# EAGLE design RPi-Proto-HAT_v10 (EAGLE 6.6.0)
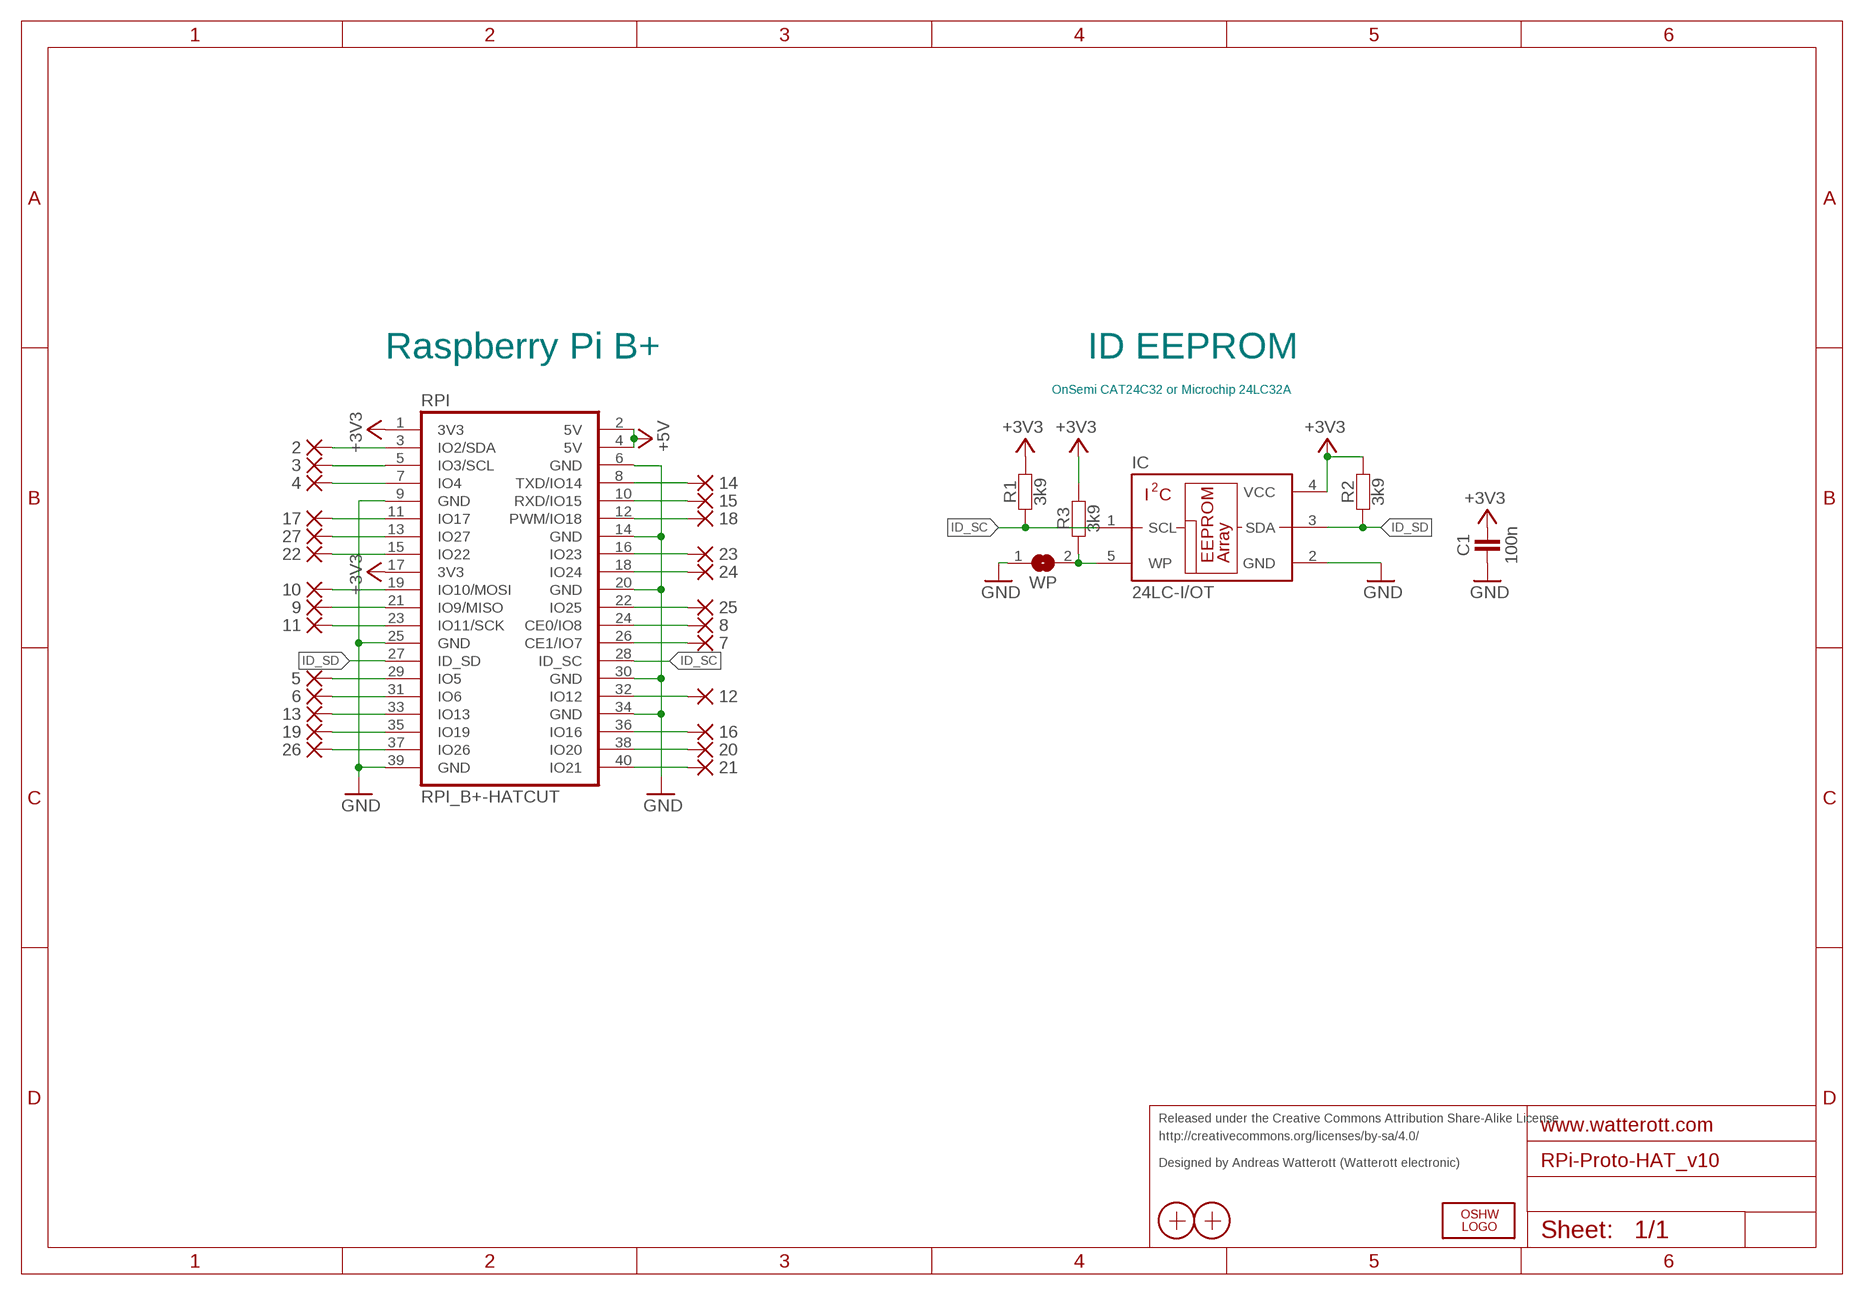
[diagram p0: schematic, sheet 1]

## Parts
2  PAD-1-1.6  [PAD-1-1.6]
3  PAD-1-1.6  [PAD-1-1.6]
4  PAD-1-1.6  [PAD-1-1.6]
5  PAD-1-1.6  [PAD-1-1.6]
6  PAD-1-1.6  [PAD-1-1.6]
7  PAD-1-1.6  [PAD-1-1.6]
8  PAD-1-1.6  [PAD-1-1.6]
9  PAD-1-1.6  [PAD-1-1.6]
10  PAD-1-1.6  [PAD-1-1.6]
11  PAD-1-1.6  [PAD-1-1.6]
12  PAD-1-1.6  [PAD-1-1.6]
13  PAD-1-1.6  [PAD-1-1.6]
14  PAD-1-1.6  [PAD-1-1.6]
15  PAD-1-1.6  [PAD-1-1.6]
16  PAD-1-1.6  [PAD-1-1.6]
17  PAD-1-1.6  [PAD-1-1.6]
18  PAD-1-1.6  [PAD-1-1.6]
19  PAD-1-1.6  [PAD-1-1.6]
20  PAD-1-1.6  [PAD-1-1.6]
21  PAD-1-1.6  [PAD-1-1.6]
22  PAD-1-1.6  [PAD-1-1.6]
23  PAD-1-1.6  [PAD-1-1.6]
24  PAD-1-1.6  [PAD-1-1.6]
25  PAD-1-1.6  [PAD-1-1.6]
26  PAD-1-1.6  [PAD-1-1.6]
27  PAD-1-1.6  [PAD-1-1.6]
C1  100n  CAPACITOR-C0603  [R0603]
IC  24LC-I/OT  [SOT23-5]
LOGO2  OSHW_LOGOX0070  [OSHW_6X70]
R1  3k9  RESISTOR-R0603  [R0603]
R2  3k9  RESISTOR-R0603  [R0603]
R3  3k9  RESISTOR-R0603  [R0603]
RPI  RPI_B+-HATCUT  [RPI-B+HAT_CUTOUT]
WP  JUMPER2-NOCREAM  [JUMPER2_NC]
X1  PASSER-07  [PASSER_07MM]
X2  PASSER-07  [PASSER_07MM]

## Nets
+3V3: C1.2 IC.4(VCC) R1.2 R2.2 R3.2 RPI.1(3V3) RPI.17(3V3)
+5V: RPI.2(5V) RPI.4(5V)
GND: C1.1 IC.2(GND) RPI.6(GND) RPI.9(GND) RPI.14(GND) RPI.20(GND) RPI.25(GND) RPI.30(GND) RPI.34(GND) RPI.39(GND) WP.1
ID_SC: IC.1(SCL) R1.1 RPI.28(ID_SC)
ID_SD: IC.3(SDA) R2.1 RPI.27(ID_SD)
IO2: 2.1(P) RPI.3(IO2/SDA)
IO3: 3.1(P) RPI.5(IO3/SCL)
IO4: 4.1(P) RPI.7(IO4)
IO5: 5.1(P) RPI.29(IO5)
IO6: 6.1(P) RPI.31(IO6)
IO7: 7.1(P) RPI.26(CE1/IO7)
IO8: 8.1(P) RPI.24(CE0/IO8)
IO9: 9.1(P) RPI.21(IO9/MISO)
IO10: 10.1(P) RPI.19(IO10/MOSI)
IO11: 11.1(P) RPI.23(IO11/SCK)
IO12: 12.1(P) RPI.32(IO12)
IO13: 13.1(P) RPI.33(IO13)
IO14: 14.1(P) RPI.8(TXD/IO14)
IO15: 15.1(P) RPI.10(RXD/IO15)
IO16: 16.1(P) RPI.36(IO16)
IO17: 17.1(P) RPI.11(IO17)
IO18: 18.1(P) RPI.12(PWM/IO18)
IO19: 19.1(P) RPI.35(IO19)
IO20: 20.1(P) RPI.38(IO20)
IO21: 21.1(P) RPI.40(IO21)
IO22: 22.1(P) RPI.15(IO22)
IO23: 23.1(P) RPI.16(IO23)
IO24: 24.1(P) RPI.18(IO24)
IO25: 25.1(P) RPI.22(IO25)
IO26: 26.1(P) RPI.37(IO26)
IO27: 27.1(P) RPI.13(IO27)
WP: IC.5(WP) R3.1 WP.2

## Notes on the sheet
- Raspberry Pi B+ | ID EEPROM
- OnSemi CAT24C32 or Microchip 24LC32A
- Released under the Creative Commons Attribution Share-Alike License
- http://creativecommons.org/licenses/by-sa/4.0/
- Designed by Andreas Watterott (Watterott electronic)

## Library data of the parts
2-27 = we-rcl:PAD
C1 = we-rcl:CAPACITOR: Capacitors ...2.2uF -> 0603 ...4.7uF -> 0805 ...10uF -> 1206
IC = we-chip:24LC*: Microchip I2C EEPROM 2 Kbit - 24LC02B - 24LC02BT-I/OTDKR-ND 32 Kbit- 24LC32A - 24LC32AT-I/OTDKR-ND; DIGIKEY: 24LC32AT-I/OTDKR-ND
LOGO2 = we-symbol:OSHW_LOGO
R1-R3 = we-rcl:RESISTOR
RPI = we-board:RPI_B+: Raspberry Pi Model B+
WP = we-rcl:JUMPER2
X1 X2 = we-symbol:PASSER

## Board
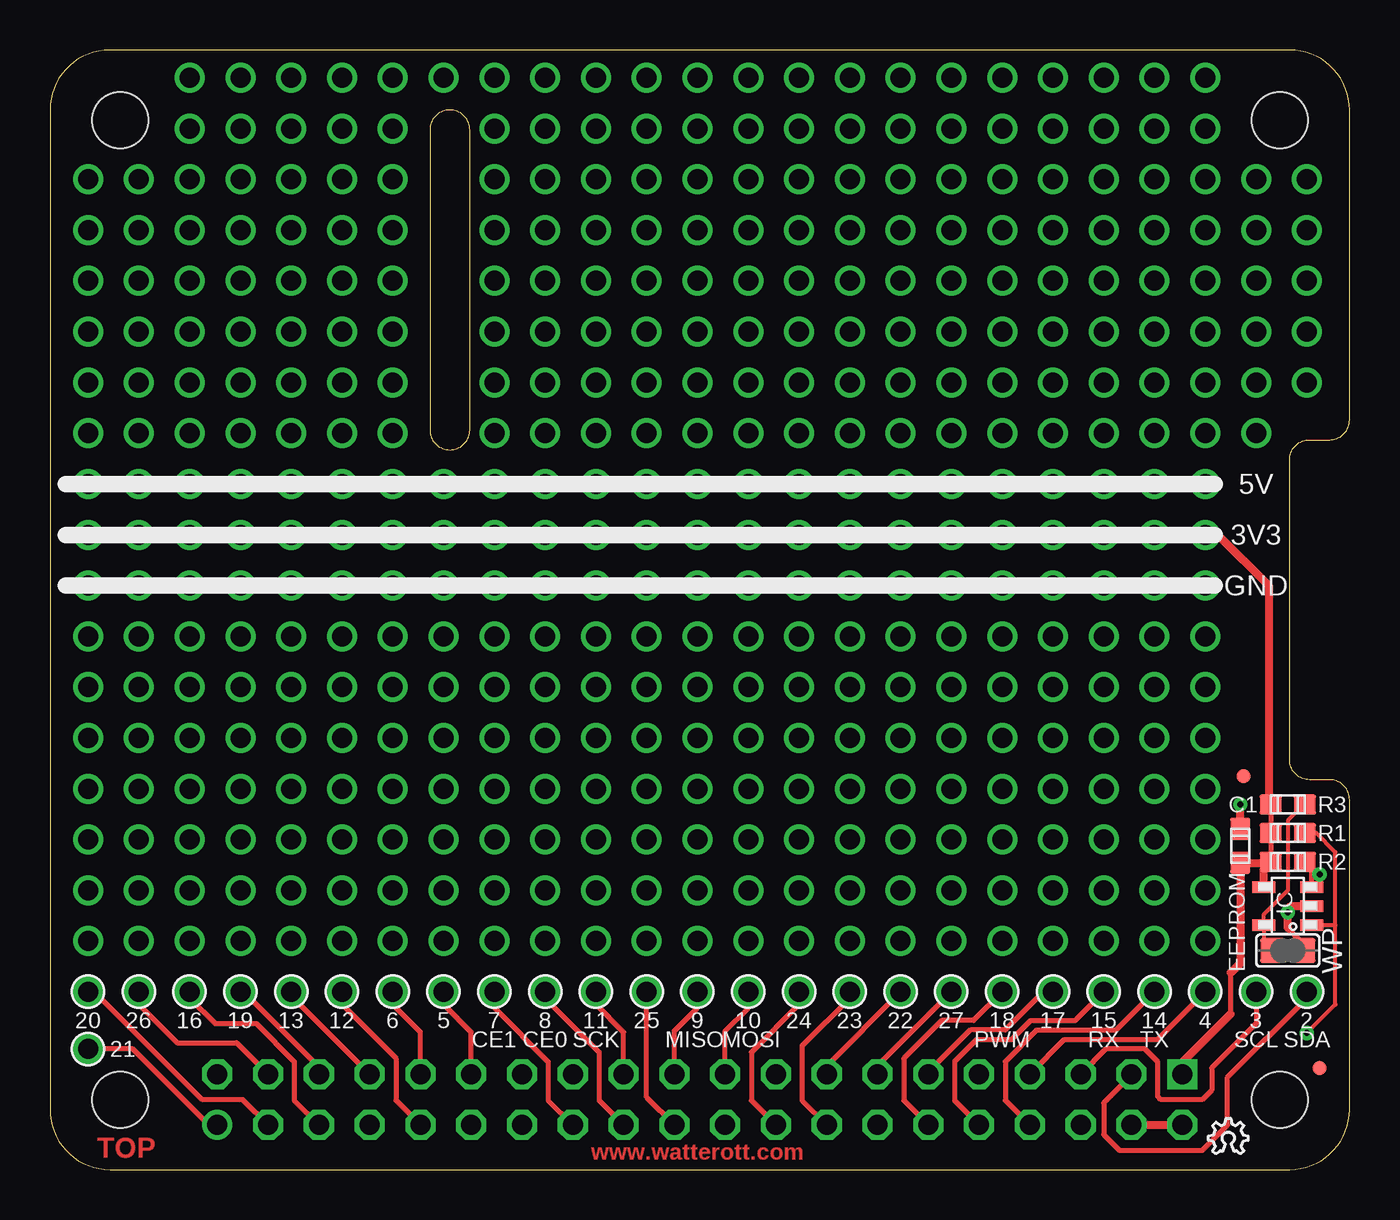
[diagram p1: board, top side]
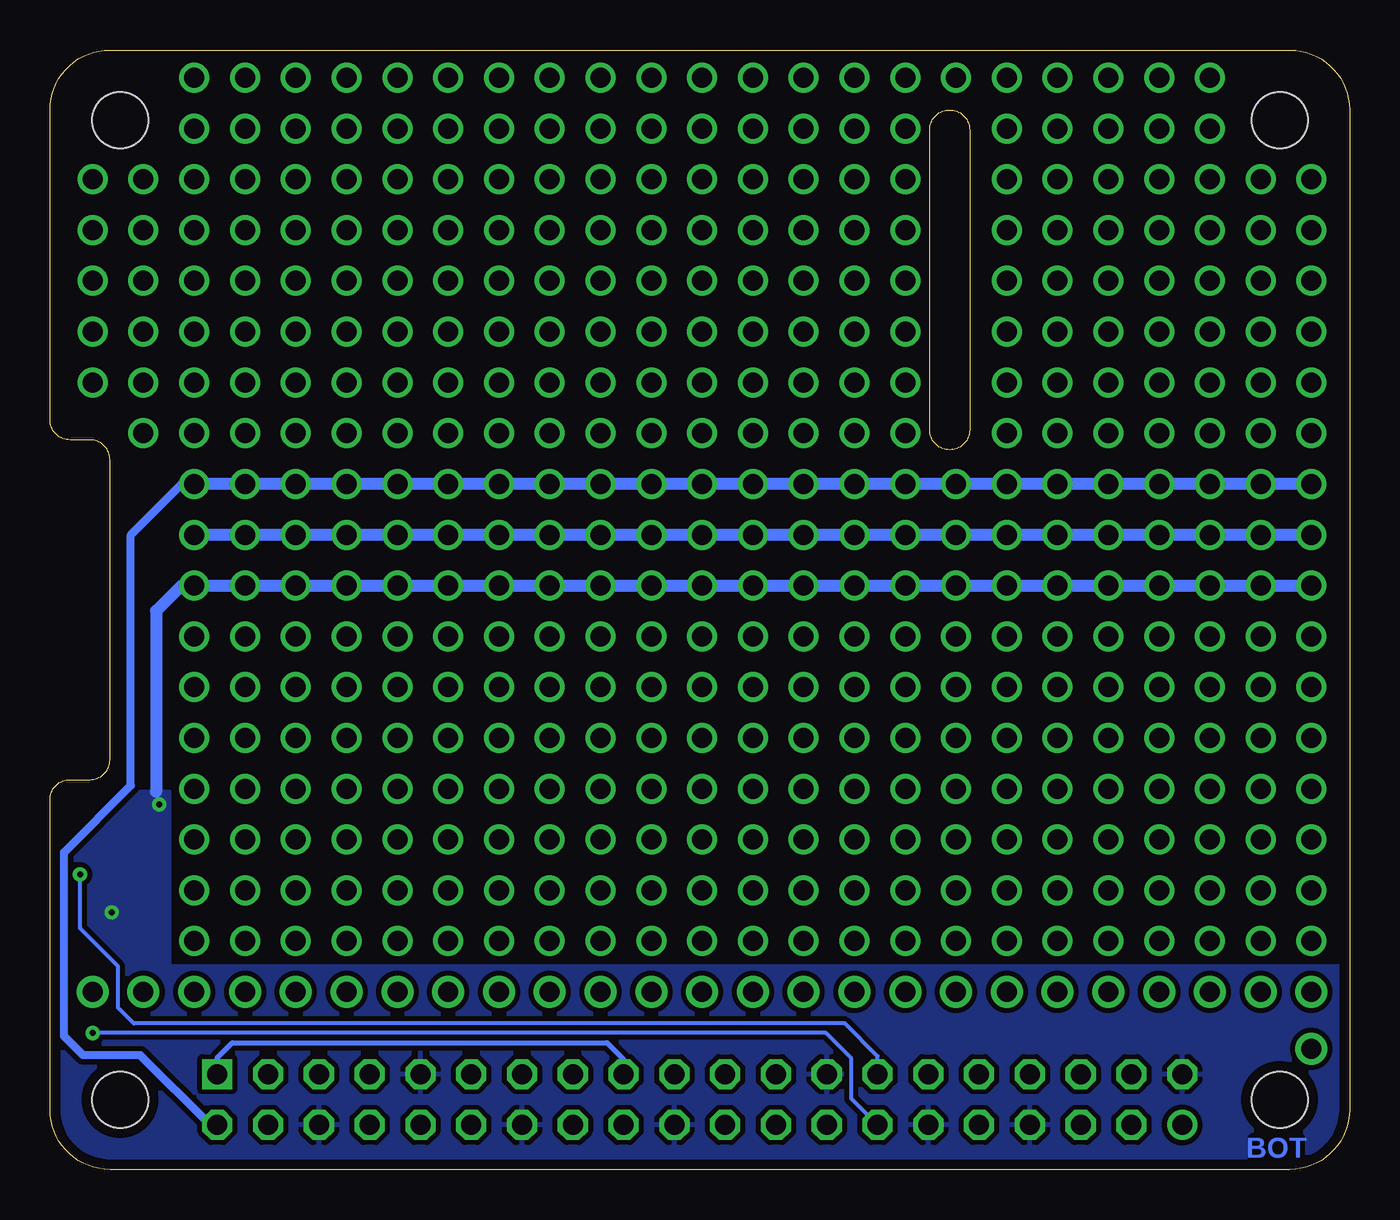
[diagram p2: board, bottom side, seen from below]

Size 65 x 56 mm. Coordinates in mm from the lower left corner, seen from the top.
Copper layers (1*16): Top 0.035mm / dielectric 1.5mm / Bottom 0.035mm
Design rules "default *": minimum track width 6mil, minimum drill 0.3mm, track to track 6mil, track to pad 6mil, pad to pad 6mil, via to via 6mil, smd to smd 6mil, copper to edge 20mil, drill to drill 8mil, minimum pad ring 10mil, minimum via ring 8mil, stop-mask expansion 0.3mm, vias tented up to drill 0.5mm, thermal gap 10mil

### Footprints (pad centres in the part's own frame; a part is rotated, then mirrored left to right if it is on the bottom)
PAD-1-1.6 = drill 1 pad 1.6: 1 0,0
R0603 = smd 1 x 1.1: 1 0,0.85; 2 0,-0.85
SOT23-5 = smd 1.2 x 0.6: 1 -1.2,0.95; 2 -1.2,0; 3 -1.2,-0.95; 4 1.2,-0.95; 5 1.2,0.95
RPI-B+HAT_CUTOUT = drill 1 square: 1 56.63,4.77 | drill 1 octagon: 2 56.63,2.23; 3 54.09,4.77; 4 54.09,2.23; 5 51.55,4.77; 6 51.55,2.23; 7 49.01,4.77; 8 49.01,2.23; 9 46.47,4.77; 10 46.47,2.23; 11 43.93,4.77; 12 43.93,2.23; 13 41.39,4.77; 14 41.39,2.23; 15 38.85,4.77; 16 38.85,2.23; 17 36.31,4.77; 18 36.31,2.23; 19 33.77,4.77; 20 33.77,2.23; 21 31.23,4.77; 22 31.23,2.23; 23 28.69,4.77; 24 28.69,2.23; 25 26.15,4.77; 26 26.15,2.23; 27 23.61,4.77; 28 23.61,2.23; 29 21.07,4.77; 30 21.07,2.23; 31 18.53,4.77; 32 18.53,2.23; 33 15.99,4.77; 34 15.99,2.23; 35 13.45,4.77; 36 13.45,2.23; 37 10.91,4.77; 38 10.91,2.23; 39 8.37,4.77 | drill 1: 40 8.37,2.23 | hole 2.8: 3.5,3.5; 3.5,52.5; 61.5,52.5; 61.5,3.5
JUMPER2_NC = smd 1.25 x 1.25: 1 0,0.76; 2 0,-0.76
PASSER_07MM = smd 0.7 x 0.7: X 0,0

### Placement (x,y rotation side)
2  62.87,8.89 0 top
3  60.33,8.89 0 top
4  57.78,8.89 0 top
5  19.68,8.89 0 top
6  17.14,8.89 0 top
7  22.23,8.89 0 top
8  24.77,8.89 0 top
9  32.38,8.89 0 top
10  34.92,8.89 0 top
11  27.3,8.89 0 top
12  14.61,8.89 0 top
13  12.06,8.89 0 top
14  55.24,8.89 0 top
15  52.7,8.89 0 top
16  6.99,8.89 0 top
17  50.16,8.89 0 top
18  47.62,8.89 0 top
19  9.53,8.89 0 top
20  1.91,8.89 0 top
21  1.91,6.03 0 top
22  42.55,8.89 0 top
23  40.01,8.89 0 top
24  37.47,8.89 0 top
25  29.84,8.89 0 top
26  4.45,8.89 0 top
27  45.09,8.89 0 top
C1  59.53,16.19 0 top
IC  61.91,13.18 180 top
LOGO2  57.94,0.79 0 top
R1  61.91,16.83 270 top
R2  61.91,15.4 270 top
R3  61.91,18.26 270 top
RPI  0,0 0 top
WP  61.91,10.95 270 top
X1  59.69,19.68 0 top
X2  63.5,5.08 0 top

### Tracks (layer width: path | path; a pad name or v marks a point on that pad's centre or on a via)
+3V3  (via drill 1)
  Top 0.254: R1.2 R3.2 60.96,18.36 | R1.2 61.06,16.73 61.12,16.67 61.12,16.77 R1.2 | R1.2 R2.2 60.93,15.27 60.71,15.05 | 59.53,15.4 C1.2 | 59.05,7.78 59.05,9.84
  Top 0.406: IC.4 60.71,15.05 | 60.93,15.27 60.86,15.34 C1.2 59.53,10.32 59.05,9.84 | v57.78,31.75 58.42,31.75 60.96,29.21 60.96,18.36 | RPI.1 56.63,5.35 59.05,7.78
  Top 0.61: v1.91,31.75 v57.78,31.75
  Bottom 0.254: RPI.1 56.63,5.6 55.88,6.35 37.15,6.35 36.31,5.51 RPI.17
  Bottom 0.61: v1.91,31.75 v57.78,31.75
+5V  (via drill 1)
  Top 0.406: RPI.4 RPI.2
  Top 0.61: v1.91,34.29 v57.78,34.29
  Bottom 0.406: RPI.2 57,2.23 60.48,5.71 63.34,5.71 64.29,6.67 64.29,15.88 60.96,19.21 60.96,31.75 58.42,34.29 v57.78,34.29
  Bottom 0.61: v1.91,34.29 v57.78,34.29
GND  (via drill 0.3, 1)
  Top 0.254: WP.1 62.67,11.3 61.91,12.06 | v61.91,12.86 61.91,13.02
  Top 0.406: 61.91,12.06 v61.91,12.86 | 61.91,13.02 62.07,13.18 IC.2 | C1.1 v59.53,18.26
  Top 0.61: v1.91,29.21 v57.78,29.21
  Bottom 0.406: v57.78,29.21 58.42,29.21
  Bottom 0.61: v57.78,29.21 v1.91,29.21 | 58.42,29.21 59.69,27.94 59.69,18.89
  pour Bottom (isolate 0.254): 0.32,0 64.77,0 64.77,10.16 0.32,10.16
  pour Bottom (isolate 0.254): 59.05,10.16 64.77,10.16 64.77,18.89 59.05,18.89
ID_SC  (via drill 0.3)
  Top 0.203: 64.29,12.22 64.29,15.88 63.34,16.83 R1.1 | 64.29,12.22 IC.1 | v62.87,6.83 64.29,8.26 64.29,12.22
  Bottom 0.203: RPI.28 24.92,3.54 24.92,5.56 26.19,6.83 v62.87,6.83
ID_SD  (via drill 0.3)
  Top 0.254: IC.3 63.11,14.76 | 63.11,14.76 63.11,15.05 R2.1 | v63.5,14.76 63.11,14.76
  Bottom 0.203: RPI.27 23.61,5.67 25.24,7.3 60.8,7.3 61.59,8.1 61.59,10.16 63.5,12.06 v63.5,14.76
IO2
  Top 0.254: 2.1 62.87,8.57 58.9,4.6 58.9,2.22 57.63,0.95 53.5,0.95 52.7,1.75 52.7,3.33 54.09,4.72 RPI.3
IO3
  Top 0.254: 3.1 60.33,7.3 58.1,5.08 58.1,3.97 57.63,3.49 55.56,3.49 55.4,3.65 55.4,5.4 54.77,6.03 52.81,6.03 RPI.5
IO4
  Top 0.254: RPI.7 50.75,6.51 55.4,6.51 4.1
IO5
  Top 0.254: 5.1 19.68,8.26 21.07,6.87 RPI.29
IO6
  Top 0.254: 6.1 17.14,8.26 18.53,6.87 RPI.31
IO7
  Top 0.254: 7.1 22.23,8.1 24.92,5.4 24.92,3.46 RPI.26
IO8
  Top 0.254: 8.1 24.77,8.57 27.46,5.87 27.46,3.46 RPI.24
IO9
  Top 0.254: 9.1 32.38,8.1 31.23,6.94 RPI.21
IO10
  Top 0.254: RPI.19 33.77,6.94 34.92,8.1 10.1
IO11
  Top 0.254: RPI.23 28.69,6.87 27.3,8.26 11.1
IO12
  Top 0.254: 12.1 14.61,8.26 17.3,5.56 17.3,3.46 RPI.32
IO13
  Top 0.254: 13.1 12.06,8.7 RPI.33
IO14
  Top 0.254: RPI.8 47.78,3.46 47.78,5.4 49.37,6.99 53.34,6.99 14.1
IO15
  Top 0.254: 15.1 51.28,7.46 49.05,7.46 48.1,6.51 46.35,6.51 45.24,5.4 45.24,3.46 RPI.10
IO16
  Top 0.254: 16.1 6.99,8.57 8.26,7.3 10.32,7.3 12.22,5.4 12.22,3.46 RPI.36
IO17
  Top 0.254: RPI.11 43.93,4.88 46.04,6.99 47.78,6.99 49.69,8.89 17.1
IO18
  Top 0.254: 18.1 46.2,7.46 44.61,7.46 42.7,5.56 42.7,3.46 RPI.12
IO19
  Top 0.254: RPI.35 13.45,5.12 9.68,8.89 19.1
IO20
  Top 0.254: 20.1 2.22,8.89 7.62,3.49 9.65,3.49 RPI.38
IO21
  Top 0.254: RPI.40 7.93,2.23 4.13,6.03 21.1
IO22
  Top 0.254: RPI.15 38.85,5.2 22.1
IO23
  Top 0.254: 23.1 40.01,8.57 37.62,6.19 37.62,3.46 RPI.16
IO24
  Top 0.254: 24.1 37.47,8.26 35.08,5.87 35.08,3.46 RPI.18
IO25
  Top 0.254: 25.1 29.84,3.62 RPI.22
IO26
  Top 0.254: 26.1 4.45,8.26 6.35,6.35 9.33,6.35 RPI.37
IO27
  Top 0.254: RPI.13 41.39,5.2 27.1
N$1  (via drill 1)
  other vias: 17.14,49.53
N$2  (via drill 1)
  other vias: 22.23,49.53
N$3  (via drill 1)
  other vias: 24.77,49.53
N$4  (via drill 1)
  other vias: 27.3,49.53
N$5  (via drill 1)
  other vias: 29.84,49.53
N$6  (via drill 1)
  other vias: 32.38,49.53
N$7  (via drill 1)
  other vias: 34.92,49.53
N$8  (via drill 1)
  other vias: 37.47,49.53
N$9  (via drill 1)
  other vias: 40.01,49.53
N$10  (via drill 1)
  other vias: 42.55,49.53
N$11  (via drill 1)
  other vias: 45.09,49.53
N$12  (via drill 1)
  other vias: 47.62,49.53
N$13  (via drill 1)
  other vias: 50.16,49.53
N$14  (via drill 1)
  other vias: 52.7,49.53
N$15  (via drill 1)
  other vias: 55.24,49.53
N$16  (via drill 1)
  other vias: 57.78,49.53
N$17  (via drill 1)
  other vias: 60.33,49.53
N$18  (via drill 1)
  other vias: 1.91,46.99
N$19  (via drill 1)
  other vias: 4.45,46.99
N$20  (via drill 1)
  other vias: 6.99,46.99
N$21  (via drill 1)
  other vias: 9.53,46.99
N$22  (via drill 1)
  other vias: 12.06,46.99
N$23  (via drill 1)
  other vias: 14.61,46.99
N$24  (via drill 1)
  other vias: 17.14,46.99
N$25  (via drill 1)
  other vias: 1.91,49.53
N$26  (via drill 1)
  other vias: 22.23,46.99
N$27  (via drill 1)
  other vias: 24.77,46.99
N$28  (via drill 1)
  other vias: 27.3,46.99
N$29  (via drill 1)
  other vias: 29.84,46.99
N$30  (via drill 1)
  other vias: 32.38,46.99
N$31  (via drill 1)
  other vias: 34.92,46.99
N$32  (via drill 1)
  other vias: 37.47,46.99
N$33  (via drill 1)
  other vias: 40.01,46.99
N$34  (via drill 1)
  other vias: 42.55,46.99
N$35  (via drill 1)
  other vias: 45.09,46.99
N$36  (via drill 1)
  other vias: 47.62,46.99
N$37  (via drill 1)
  other vias: 50.16,46.99
N$38  (via drill 1)
  other vias: 52.7,46.99
N$39  (via drill 1)
  other vias: 55.24,46.99
N$40  (via drill 1)
  other vias: 57.78,46.99
N$41  (via drill 1)
  other vias: 60.33,46.99
N$42  (via drill 1)
  other vias: 62.87,49.53
N$43  (via drill 1)
  other vias: 62.87,46.99
N$44  (via drill 1)
  other vias: 1.91,44.45
N$45  (via drill 1)
  other vias: 4.45,44.45
N$46  (via drill 1)
  other vias: 6.99,44.45
N$47  (via drill 1)
  other vias: 9.53,44.45
N$48  (via drill 1)
  other vias: 1.91,41.91
N$49  (via drill 1)
  other vias: 4.45,41.91
N$50  (via drill 1)
  other vias: 6.99,41.91
N$51  (via drill 1)
  other vias: 12.06,44.45
N$52  (via drill 1)
  other vias: 1.91,39.37
N$53  (via drill 1)
  other vias: 1.91,36.83
N$57  (via drill 1)
  other vias: 1.91,26.67
N$58  (via drill 1)
  other vias: 1.91,24.13
N$59  (via drill 1)
  other vias: 1.91,21.59
N$60  (via drill 1)
  other vias: 1.91,19.05
N$61  (via drill 1)
  other vias: 1.91,16.51
N$62  (via drill 1)
  other vias: 1.91,13.97
N$63  (via drill 1)
  other vias: 1.91,11.43
N$65  (via drill 1)
  other vias: 4.45,39.37
N$66  (via drill 1)
  other vias: 6.99,39.37
N$67  (via drill 1)
  other vias: 6.99,52.07
N$68  (via drill 1)
  other vias: 6.99,54.61
N$69  (via drill 1)
  other vias: 9.53,52.07
N$70  (via drill 1)
  other vias: 9.53,54.61
N$71  (via drill 1)
  other vias: 12.06,54.61
N$72  (via drill 1)
  other vias: 12.06,52.07
N$73  (via drill 1)
  other vias: 14.61,52.07
N$74  (via drill 1)
  other vias: 14.61,54.61
N$75  (via drill 1)
  other vias: 17.14,54.61
N$76  (via drill 1)
  other vias: 17.14,52.07
N$77  (via drill 1)
  other vias: 19.68,54.61
N$78  (via drill 1)
  other vias: 4.45,49.53
N$79  (via drill 1)
  other vias: 22.23,52.07
N$80  (via drill 1)
  other vias: 22.23,54.61
N$81  (via drill 1)
  other vias: 24.77,54.61
N$82  (via drill 1)
  other vias: 24.77,52.07
N$83  (via drill 1)
  other vias: 27.3,52.07
N$84  (via drill 1)
  other vias: 27.3,54.61
N$85  (via drill 1)
  other vias: 29.84,52.07
N$86  (via drill 1)
  other vias: 29.84,54.61
N$87  (via drill 1)
  other vias: 32.38,54.61
N$88  (via drill 1)
  other vias: 32.38,52.07
N$89  (via drill 1)
  other vias: 34.92,52.07
N$90  (via drill 1)
  other vias: 34.92,54.61
N$91  (via drill 1)
  other vias: 37.47,54.61
N$92  (via drill 1)
  other vias: 37.47,52.07
N$93  (via drill 1)
  other vias: 40.01,52.07
N$94  (via drill 1)
  other vias: 40.01,54.61
N$95  (via drill 1)
  other vias: 42.55,54.61
N$96  (via drill 1)
  other vias: 42.55,52.07
N$97  (via drill 1)
  other vias: 45.09,52.07
N$98  (via drill 1)
  other vias: 45.09,54.61
N$99  (via drill 1)
  other vias: 47.62,54.61
N$100  (via drill 1)
  other vias: 47.62,52.07
N$101  (via drill 1)
  other vias: 50.16,52.07
N$102  (via drill 1)
  other vias: 50.16,54.61
N$103  (via drill 1)
  other vias: 52.7,54.61
N$104  (via drill 1)
  other vias: 52.7,52.07
N$105  (via drill 1)
  other vias: 55.24,52.07
N$106  (via drill 1)
  other vias: 55.24,54.61
N$107  (via drill 1)
  other vias: 57.78,54.61
N$108  (via drill 1)
  other vias: 57.78,52.07
N$109  (via drill 1)
  other vias: 14.61,44.45
N$111  (via drill 1)
  other vias: 4.45,11.43
N$112  (via drill 1)
  other vias: 4.45,13.97
N$113  (via drill 1)
  other vias: 4.45,16.51
N$114  (via drill 1)
  other vias: 4.45,19.05
N$115  (via drill 1)
  other vias: 4.45,21.59
N$116  (via drill 1)
  other vias: 4.45,24.13
N$117  (via drill 1)
  other vias: 4.45,26.67
N$118  (via drill 1)
  other vias: 4.45,29.21
N$119  (via drill 1)
  other vias: 4.45,31.75
N$120  (via drill 1)
  other vias: 4.45,34.29
N$121  (via drill 1)
  other vias: 4.45,36.83
N$122  (via drill 1)
  other vias: 6.99,36.83
N$123  (via drill 1)
  other vias: 6.99,34.29
N$124  (via drill 1)
  other vias: 6.99,31.75
N$125  (via drill 1)
  other vias: 6.99,29.21
N$126  (via drill 1)
  other vias: 6.99,26.67
N$127  (via drill 1)
  other vias: 6.99,24.13
N$128  (via drill 1)
  other vias: 6.99,21.59
N$129  (via drill 1)
  other vias: 6.99,19.05
N$130  (via drill 1)
  other vias: 6.99,16.51
N$131  (via drill 1)
  other vias: 6.99,13.97
N$132  (via drill 1)
  other vias: 6.99,11.43
N$135  (via drill 1)
  other vias: 9.53,11.43
N$136  (via drill 1)
  other vias: 9.53,13.97
N$137  (via drill 1)
  other vias: 9.53,16.51
N$138  (via drill 1)
  other vias: 9.53,19.05
N$139  (via drill 1)
  other vias: 9.53,21.59
N$140  (via drill 1)
  other vias: 9.53,24.13
N$141  (via drill 1)
  other vias: 9.53,26.67
N$142  (via drill 1)
  other vias: 9.53,29.21
N$143  (via drill 1)
  other vias: 9.53,31.75
N$144  (via drill 1)
  other vias: 9.53,34.29
N$145  (via drill 1)
  other vias: 9.53,36.83
N$146  (via drill 1)
  other vias: 9.53,39.37
N$147  (via drill 1)
  other vias: 9.53,41.91
N$148  (via drill 1)
  other vias: 12.06,41.91
N$149  (via drill 1)
  other vias: 14.61,41.91
N$150  (via drill 1)
  other vias: 17.14,41.91
N$151  (via drill 1)
  other vias: 17.14,44.45
N$152  (via drill 1)
  other vias: 6.99,49.53
N$153  (via drill 1)
  other vias: 9.53,49.53
N$154  (via drill 1)
  other vias: 22.23,41.91
N$155  (via drill 1)
  other vias: 22.23,44.45
N$156  (via drill 1)
  other vias: 24.77,44.45
N$157  (via drill 1)
  other vias: 24.77,41.91
N$159  (via drill 1)
  other vias: 12.06,11.43
N$160  (via drill 1)
  other vias: 12.06,13.97
N$161  (via drill 1)
  other vias: 12.06,16.51
N$162  (via drill 1)
  other vias: 12.06,19.05
N$163  (via drill 1)
  other vias: 12.06,21.59
N$164  (via drill 1)
  other vias: 12.06,24.13
N$165  (via drill 1)
  other vias: 12.06,26.67
N$166  (via drill 1)
  other vias: 12.06,29.21
N$167  (via drill 1)
  other vias: 12.06,31.75
N$168  (via drill 1)
  other vias: 12.06,34.29
N$169  (via drill 1)
  other vias: 12.06,36.83
N$170  (via drill 1)
  other vias: 12.06,39.37
N$171  (via drill 1)
  other vias: 62.87,44.45
N$172  (via drill 1)
  other vias: 60.33,44.45
N$173  (via drill 1)
  other vias: 57.78,44.45
N$174  (via drill 1)
  other vias: 55.24,44.45
N$175  (via drill 1)
  other vias: 52.7,44.45
N$176  (via drill 1)
  other vias: 50.16,44.45
N$177  (via drill 1)
  other vias: 47.62,44.45
N$178  (via drill 1)
  other vias: 45.09,44.45
N$179  (via drill 1)
  other vias: 42.55,44.45
N$180  (via drill 1)
  other vias: 40.01,44.45
N$181  (via drill 1)
  other vias: 37.47,44.45
N$182  (via drill 1)
  other vias: 34.92,44.45
N$183  (via drill 1)
  other vias: 32.38,44.45
N$184  (via drill 1)
  other vias: 29.84,44.45
N$185  (via drill 1)
  other vias: 27.3,44.45
N$186  (via drill 1)
  other vias: 27.3,41.91
N$187  (via drill 1)
  other vias: 29.84,41.91
N$188  (via drill 1)
  other vias: 32.38,41.91
N$189  (via drill 1)
  other vias: 34.92,41.91
N$190  (via drill 1)
  other vias: 37.47,41.91
N$191  (via drill 1)
  other vias: 40.01,41.91
N$192  (via drill 1)
  other vias: 42.55,41.91
N$193  (via drill 1)
  other vias: 45.09,41.91
N$194  (via drill 1)
  other vias: 47.62,41.91
N$195  (via drill 1)
  other vias: 50.16,41.91
N$196  (via drill 1)
  other vias: 52.7,41.91
N$197  (via drill 1)
  other vias: 55.24,41.91
N$198  (via drill 1)
  other vias: 57.78,41.91
N$199  (via drill 1)
  other vias: 60.33,41.91
N$200  (via drill 1)
  other vias: 62.87,41.91
N$201  (via drill 1)
  other vias: 14.61,39.37
N$202  (via drill 1)
  other vias: 17.14,39.37
N$203  (via drill 1)
  other vias: 14.61,36.83
N$204  (via drill 1)
  other vias: 17.14,36.83
N$205  (via drill 1)
  other vias: 14.61,34.29
N$206  (via drill 1)
  other vias: 17.14,34.29
N$207  (via drill 1)
  other vias: 14.61,31.75
N$208  (via drill 1)
  other vias: 17.14,31.75
N$209  (via drill 1)
  other vias: 14.61,29.21
N$210  (via drill 1)
  other vias: 17.14,29.21
N$211  (via drill 1)
  other vias: 14.61,26.67
N$212  (via drill 1)
  other vias: 17.14,26.67
N$213  (via drill 1)
  other vias: 14.61,24.13
N$214  (via drill 1)
  other vias: 17.14,24.13
N$215  (via drill 1)
  other vias: 14.61,21.59
N$216  (via drill 1)
  other vias: 17.14,21.59
N$217  (via drill 1)
  other vias: 12.06,49.53
N$218  (via drill 1)
  other vias: 22.23,39.37
N$219  (via drill 1)
  other vias: 24.77,39.37
N$220  (via drill 1)
  other vias: 14.61,49.53
N$221  (via drill 1)
  other vias: 22.23,36.83
N$222  (via drill 1)
  other vias: 24.77,36.83
N$223  (via drill 1)
  other vias: 19.68,34.29
N$224  (via drill 1)
  other vias: 22.23,34.29
N$225  (via drill 1)
  other vias: 24.77,34.29
N$226  (via drill 1)
  other vias: 24.77,31.75
N$227  (via drill 1)
  other vias: 22.23,31.75
N$228  (via drill 1)
  other vias: 19.68,31.75
N$229  (via drill 1)
  other vias: 27.3,39.37
N$230  (via drill 1)
  other vias: 29.84,39.37
N$231  (via drill 1)
  other vias: 27.3,36.83
N$232  (via drill 1)
  other vias: 29.84,36.83
N$233  (via drill 1)
  other vias: 27.3,34.29
N$234  (via drill 1)
  other vias: 29.84,34.29
N$235  (via drill 1)
  other vias: 27.3,31.75
N$236  (via drill 1)
  other vias: 29.84,31.75
N$237  (via drill 1)
  other vias: 62.87,39.37
N$238  (via drill 1)
  other vias: 60.33,39.37
N$239  (via drill 1)
  other vias: 57.78,39.37
N$240  (via drill 1)
  other vias: 55.24,39.37
N$241  (via drill 1)
  other vias: 52.7,39.37
N$242  (via drill 1)
  other vias: 50.16,39.37
N$243  (via drill 1)
  other vias: 47.62,39.37
N$244  (via drill 1)
  other vias: 45.09,39.37
N$245  (via drill 1)
  other vias: 42.55,39.37
N$246  (via drill 1)
  other vias: 40.01,39.37
N$247  (via drill 1)
  other vias: 37.47,39.37
N$248  (via drill 1)
  other vias: 34.92,39.37
N$249  (via drill 1)
  other vias: 32.38,39.37
N$250  (via drill 1)
  other vias: 32.38,36.83
N$251  (via drill 1)
  other vias: 32.38,34.29
N$252  (via drill 1)
  other vias: 32.38,31.75
N$253  (via drill 1)
  other vias: 34.92,31.75
N$254  (via drill 1)
  other vias: 34.92,34.29
N$255  (via drill 1)
  other vias: 34.92,36.83
N$256  (via drill 1)
  other vias: 37.47,36.83
N$257  (via drill 1)
  other vias: 37.47,34.29
N$258  (via drill 1)
  other vias: 37.47,31.75
N$259  (via drill 1)
  other vias: 40.01,31.75
N$260  (via drill 1)
  other vias: 40.01,34.29
N$261  (via drill 1)
  other vias: 40.01,36.83
N$262  (via drill 1)
  other vias: 42.55,36.83
N$264  (via drill 1)
  other vias: 60.33,36.83
N$265  (via drill 1)
  other vias: 57.78,36.83
N$266  (via drill 1)
  other vias: 55.24,36.83
N$267  (via drill 1)
  other vias: 52.7,36.83
N$268  (via drill 1)
  other vias: 50.16,36.83
N$269  (via drill 1)
  other vias: 47.62,36.83
N$270  (via drill 1)
  other vias: 45.09,36.83
N$271  (via drill 1)
  other vias: 42.55,34.29
N$272  (via drill 1)
  other vias: 45.09,34.29
N$273  (via drill 1)
  other vias: 47.62,34.29
N$274  (via drill 1)
  other vias: 50.16,34.29
N$275  (via drill 1)
  other vias: 52.7,34.29
N$276  (via drill 1)
  other vias: 55.24,34.29
N$283  (via drill 1)
  other vias: 55.24,31.75
N$284  (via drill 1)
  other vias: 52.7,31.75
N$285  (via drill 1)
  other vias: 50.16,31.75
N$286  (via drill 1)
  other vias: 47.62,31.75
N$287  (via drill 1)
  other vias: 45.09,31.75
N$288  (via drill 1)
  other vias: 42.55,31.75
N$289  (via drill 1)
  other vias: 19.68,29.21
N$290  (via drill 1)
  other vias: 19.68,26.67
N$291  (via drill 1)
  other vias: 19.68,24.13
N$292  (via drill 1)
  other vias: 19.68,21.59
N$294  (via drill 1)
  other vias: 14.61,11.43
N$295  (via drill 1)
  other vias: 14.61,13.97
N$296  (via drill 1)
  other vias: 14.61,16.51
N$297  (via drill 1)
  other vias: 14.61,19.05
N$298  (via drill 1)
  other vias: 17.14,19.05
N$299  (via drill 1)
  other vias: 19.68,19.05
N$300  (via drill 1)
  other vias: 17.14,16.51
N$301  (via drill 1)
  other vias: 19.68,16.51
N$302  (via drill 1)
  other vias: 17.14,13.97
N$303  (via drill 1)
  other vias: 19.68,13.97
N$304  (via drill 1)
  other vias: 17.14,11.43
N$305  (via drill 1)
  other vias: 19.68,11.43
N$309  (via drill 1)
  other vias: 22.23,11.43
N$310  (via drill 1)
  other vias: 22.23,13.97
N$311  (via drill 1)
  other vias: 22.23,16.51
N$312  (via drill 1)
  other vias: 22.23,19.05
N$339  (via drill 1)
  other vias: 55.24,29.21
N$340  (via drill 1)
  other vias: 52.7,29.21
N$341  (via drill 1)
  other vias: 50.16,29.21
N$342  (via drill 1)
  other vias: 50.16,26.67
N$343  (via drill 1)
  other vias: 52.7,26.67
N$344  (via drill 1)
  other vias: 55.24,26.67
N$345  (via drill 1)
  other vias: 57.78,26.67
N$348  (via drill 1)
  other vias: 57.78,24.13
N$349  (via drill 1)
  other vias: 55.24,24.13
N$350  (via drill 1)
  other vias: 52.7,24.13
N$351  (via drill 1)
  other vias: 50.16,24.13
N$352  (via drill 1)
  other vias: 50.16,21.59
N$353  (via drill 1)
  other vias: 52.7,21.59
N$354  (via drill 1)
  other vias: 55.24,21.59
N$355  (via drill 1)
  other vias: 57.78,21.59
N$358  (via drill 1)
  other vias: 57.78,19.05
N$359  (via drill 1)
  other vias: 55.24,19.05
N$360  (via drill 1)
  other vias: 52.7,19.05
N$361  (via drill 1)
  other vias: 50.16,19.05
N$362  (via drill 1)
  other vias: 50.16,16.51
N$363  (via drill 1)
  other vias: 50.16,11.43
N$364  (via drill 1)
  other vias: 50.16,13.97
N$365  (via drill 1)
  other vias: 52.7,16.51
N$366  (via drill 1)
  other vias: 52.7,13.97
N$367  (via drill 1)
  other vias: 52.7,11.43
N$368  (via drill 1)
  other vias: 55.24,11.43
N$369  (via drill 1)
  other vias: 55.24,13.97
N$370  (via drill 1)
  other vias: 55.24,16.51
N$371  (via drill 1)
  other vias: 57.78,16.51
N$374  (via drill 1)
  other vias: 57.78,13.97
N$375  (via drill 1)
  other vias: 57.78,11.43
N$377  (via drill 1)
  other vias: 22.23,21.59
N$378  (via drill 1)
  other vias: 22.23,24.13
N$379  (via drill 1)
  other vias: 22.23,26.67
N$380  (via drill 1)
  other vias: 22.23,29.21
N$381  (via drill 1)
  other vias: 24.77,29.21
N$382  (via drill 1)
  other vias: 27.3,29.21
N$383  (via drill 1)
  other vias: 29.84,29.21
N$384  (via drill 1)
  other vias: 32.38,29.21
N$385  (via drill 1)
  other vias: 32.38,26.67
N$386  (via drill 1)
  other vias: 29.84,26.67
N$387  (via drill 1)
  other vias: 27.3,26.67
N$388  (via drill 1)
  other vias: 24.77,26.67
N$389  (via drill 1)
  other vias: 24.77,24.13
N$390  (via drill 1)
  other vias: 27.3,24.13
N$391  (via drill 1)
  other vias: 29.84,24.13
N$392  (via drill 1)
  other vias: 29.84,21.59
N$393  (via drill 1)
  other vias: 27.3,21.59
N$394  (via drill 1)
  other vias: 24.77,21.59
N$395  (via drill 1)
  other vias: 24.77,19.05
N$396  (via drill 1)
  other vias: 27.3,19.05
N$397  (via drill 1)
  other vias: 29.84,19.05
N$398  (via drill 1)
  other vias: 29.84,16.51
N$399  (via drill 1)
  other vias: 27.3,16.51
N$400  (via drill 1)
  other vias: 24.77,16.51
N$401  (via drill 1)
  other vias: 24.77,11.43
N$402  (via drill 1)
  other vias: 24.77,13.97
N$403  (via drill 1)
  other vias: 27.3,13.97
N$404  (via drill 1)
  other vias: 27.3,11.43
N$405  (via drill 1)
  other vias: 29.84,11.43
N$406  (via drill 1)
  other vias: 29.84,13.97
N$407  (via drill 1)
  other vias: 32.38,11.43
N$408  (via drill 1)
  other vias: 32.38,13.97
N$409  (via drill 1)
  other vias: 32.38,16.51
N$410  (via drill 1)
  other vias: 32.38,19.05
N$411  (via drill 1)
  other vias: 32.38,21.59
N$412  (via drill 1)
  other vias: 32.38,24.13
N$413  (via drill 1)
  other vias: 34.92,29.21
N$414  (via drill 1)
  other vias: 37.47,29.21
N$415  (via drill 1)
  other vias: 40.01,29.21
N$416  (via drill 1)
  other vias: 42.55,29.21
N$417  (via drill 1)
  other vias: 45.09,29.21
N$418  (via drill 1)
  other vias: 47.62,29.21
N$419  (via drill 1)
  other vias: 47.62,26.67
N$420  (via drill 1)
  other vias: 47.62,24.13
N$421  (via drill 1)
  other vias: 47.62,21.59
N$422  (via drill 1)
  other vias: 47.62,19.05
N$423  (via drill 1)
  other vias: 47.62,11.43
N$424  (via drill 1)
  other vias: 47.62,13.97
N$425  (via drill 1)
  other vias: 47.62,16.51
N$426  (via drill 1)
  other vias: 45.09,11.43
N$427  (via drill 1)
  other vias: 42.55,11.43
N$428  (via drill 1)
  other vias: 40.01,11.43
N$429  (via drill 1)
  other vias: 37.47,11.43
N$430  (via drill 1)
  other vias: 34.92,11.43
N$431  (via drill 1)
  other vias: 34.92,13.97
N$432  (via drill 1)
  other vias: 37.47,13.97
N$433  (via drill 1)
  other vias: 40.01,13.97
N$434  (via drill 1)
  other vias: 42.55,13.97
N$435  (via drill 1)
  other vias: 45.09,13.97
N$436  (via drill 1)
  other vias: 45.09,16.51
N$437  (via drill 1)
  other vias: 45.09,19.05
N$438  (via drill 1)
  other vias: 45.09,21.59
N$439  (via drill 1)
  other vias: 45.09,24.13
N$440  (via drill 1)
  other vias: 45.09,26.67
N$441  (via drill 1)
  other vias: 42.55,26.67
N$442  (via drill 1)
  other vias: 40.01,26.67
N$443  (via drill 1)
  other vias: 37.47,26.67
N$444  (via drill 1)
  other vias: 34.92,26.67
N$445  (via drill 1)
  other vias: 34.92,24.13
N$446  (via drill 1)
  other vias: 34.92,21.59
N$447  (via drill 1)
  other vias: 34.92,19.05
N$448  (via drill 1)
  other vias: 34.92,16.51
N$449  (via drill 1)
  other vias: 37.47,16.51
N$450  (via drill 1)
  other vias: 40.01,16.51
N$451  (via drill 1)
  other vias: 42.55,16.51
N$452  (via drill 1)
  other vias: 42.55,19.05
N$453  (via drill 1)
  other vias: 42.55,21.59
N$454  (via drill 1)
  other vias: 42.55,24.13
N$455  (via drill 1)
  other vias: 40.01,24.13
N$456  (via drill 1)
  other vias: 37.47,24.13
N$457  (via drill 1)
  other vias: 37.47,21.59
N$458  (via drill 1)
  other vias: 40.01,21.59
N$459  (via drill 1)
  other vias: 40.01,19.05
N$460  (via drill 1)
  other vias: 37.47,19.05
WP
  Top 0.203: R3.1 62.71,18.26 61.91,17.46 61.91,13.97 60.71,12.77 IC.5 60.71,11.39 WP.2
  Top 0.254: IC.5

### Text on the board
Top: TOP | www.watterott.com
Bottom: BOT
tPlace: EEPROM
tNames: 5V | 3V3 | GND | CE1 | CE0 | SCK | MISO | MOSI | PWM | RX | TX | SCL | SDA
Reference: Silkscreen: 21 tPlace + 25 tNames